# Altium schematic sheet Measuring_distance_ultrasonic_Sheet.SchDoc
size A2
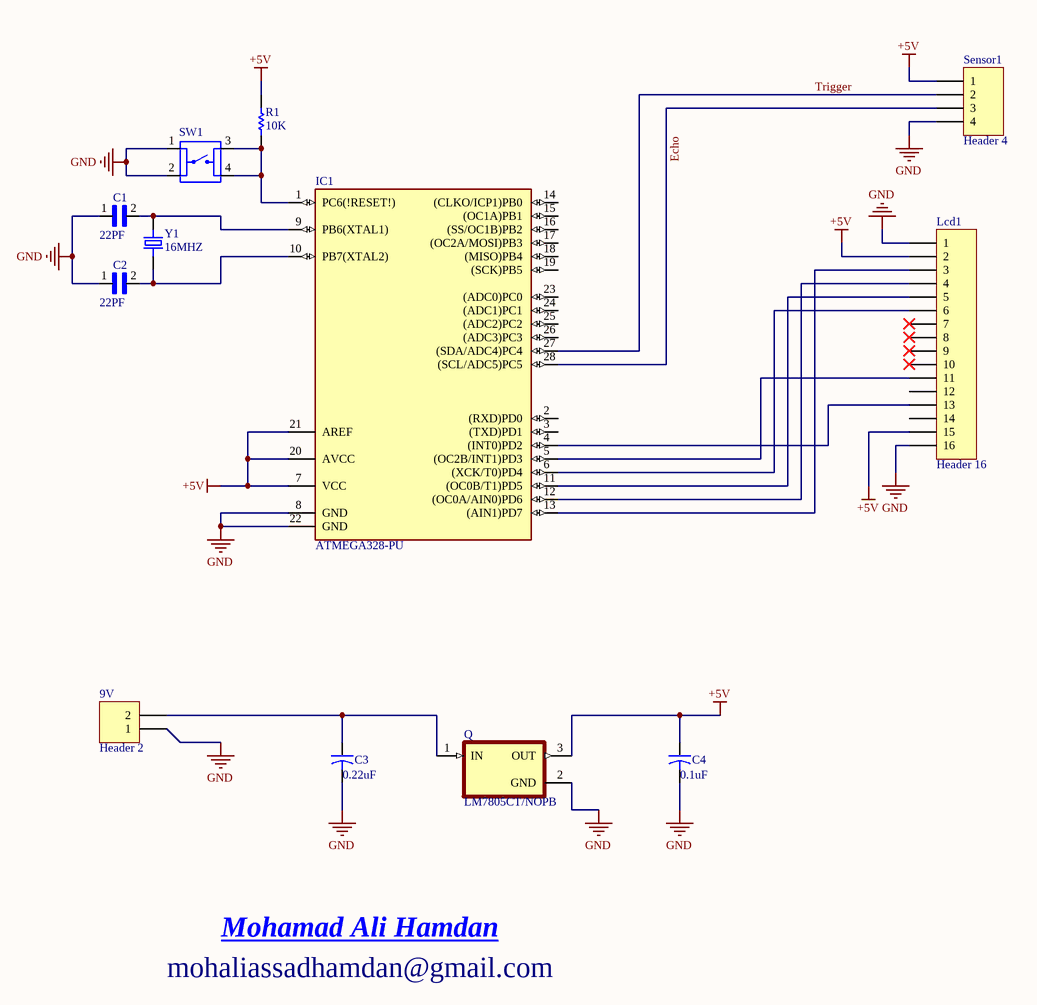
[diagram p0: Measuring_distance_ultrasonic_Sheet.SchDoc]

## Parts
9V  Header 2  [Connector_green_2pins]
C1  BuyPart: 22PF  [CAP_RDER71H333K0M1H03A]  (hidden comment: 14pF)
C2  BuyPart: 22PF  [CAP_RDER71H333K0M1H03A]  (hidden comment: 14pF)
C3  value 0.22uF  [Capacitor_polarized_100uF]  (hidden comment: Cap2)
C4  value 0.1uF  [Capacitor_polarized_100uF]  (hidden comment: Cap2)
IC1  ATMEGA328-PU  [DIL28]
Lcd1  Header 16  [LCD_16_2]
Q  LM7805CT/NOPB  [LM7805]
R1  value 10K  [resistor]  (hidden comment: Res1)
Sensor1  Header 4  [header_4]
SW1  FSM8JH  [SW_FSM8JH]  (value not drawn)
Y1  16MHZ  [XTAL_ECS-160-20-4VX]

## Nets
+5V: C4.1 IC1.7(VCC) IC1.20(AVCC) IC1.21(AREF) Lcd1.2 Lcd1.15 Q.3(OUT) R1.2 Sensor1.1
GND: 9V.1 C1.1 C2.1 C3.2 C4.2 IC1.8(GND) IC1.22(GND) Lcd1.1 Lcd1.16 Q.2(GND) Sensor1.4 SW1.1 SW1.2
Echo: IC1.28((SCL/ADC5)PC5) Sensor1.3
Trigger: IC1.27((SDA/ADC4)PC4) Sensor1.2
Net9V_2: 9V.2 C3.1 Q.1(IN)
NetC1_2: C1.2 IC1.9(PB6(XTAL1)) Y1.2
NetC2_2: C2.2 IC1.10(PB7(XTAL2)) Y1.1
NetIC1_1: IC1.1(PC6(!RESET!)) R1.1 SW1.3 SW1.4
NetIC1_4: IC1.4((INT0)PD2) Lcd1.13
NetIC1_5: IC1.5((OC2B/INT1)PD3) Lcd1.11
NetIC1_6: IC1.6((XCK/T0)PD4) Lcd1.6
NetIC1_11: IC1.11((OC0B/T1)PD5) Lcd1.5
NetIC1_12: IC1.12((OC0A/AIN0)PD6) Lcd1.4
NetIC1_13: IC1.13((AIN1)PD7) Lcd1.3

Not connected (* = marked no-connect by the designer): IC1 2((RXD)PD0) 3((TXD)PD1) 14((CLKO/ICP1)PB0) 15((OC1A)PB1) 16((SS/OC1B)PB2) 17((OC2A/MOSI)PB3) 18((MISO)PB4) 19((SCK)PB5) 23((ADC0)PC0) 24((ADC1)PC1) 25((ADC2)PC2) 26((ADC3)PC3); Lcd1 7* 8* 9* 10* 12 14

## Notes on the sheet
- mohaliassadhamdan@gmail.com
- Mohamad Ali Hamdan

## Library data of the parts
9V = Header 2: Header, 2-Pin; LatestRevisionDate: 17-Jul-2002; LatestRevisionNote: Re-released for DXP Platform.; Publisher: Altium Limited
C1 C2 = RDER71H333K0M1H03A: Lead capacitor X7R(EIA) with Capacitance 33000pF, Rated Voltage 50Vdc; MF: Murata; SnapEDA_Link: https://www.snapeda.com/parts/RDER71H333K0M1H03A/Murata/view-part/4546735/?ref=snap; Availability: Warning; Price: None; Package: Radial Murata; Value: *; MP: RDER71H333K0M1H03A; Mouser-Purchase-URL: https://snapeda.com/shop?store=Mouser&id=4546735
C3 C4 = Cap2: Capacitor; pin to pad: 1>+ 2>-; Published: 23-Sep-2002; PackageReference: CAPR5-4X5; Publisher: Altium Limited; PackageDescription: Capacitor; 2 Leads
IC1 = ATMEGA328-PU: AVR AVRÂ® ATmega Microcontroller IC 8-Bit 20MHz 32KB _16K x 16_ FLASH 28-PDIP; MF: Microchip Technology; Package: DIP-28 Microchip Technology; Price: None; Availability: Unavailable; MP: ATMEGA328-PU; SnapEDA_Link: https://www.snapeda.com/parts/ATMEGA328-PU/Microchip/view-part/4327846/?ref=snap; Value: *
Lcd1 = Header 16: Header, 16-Pin; LatestRevisionDate: 17-Jul-2002; LatestRevisionNote: Re-released for DXP Platform.; Publisher: Altium Limited
Q = LM7805CT/NOPB: Linear Voltage Regulator IC 1 Output 1A TO-220-3; MF: ON Semiconductor; MP: LM7805CT; SnapEDA_Link: https://www.snapeda.com/parts/LM7805CT/ON%20Semiconductor/view-part/546231/?ref=snap; Price: None; Package: TO-220 ON Semiconductor; Value: *; Availability: Unavailable
R1 = Res1: Resistor; Published: 8-Jun-2000; LatestRevisionDate: 17-Jul-2002; LatestRevisionNote: Re-released for DXP Platform.; PackageReference: AXIAL-0.3; Publisher: Altium Limited; PackageDescription: Axial Device, Thru-Hole; 2 Leads; 0.3 in Pin Spacing
Sensor1 = Header 4: Header, 4-Pin; LatestRevisionDate: 17-Jul-2002; LatestRevisionNote: Re-released for DXP Platform.; Publisher: Altium Limited
SW1 = FSM8JH: Tactile Switch SPST-NO Top Actuated Through Hole; MF: TE Connectivity; MP: FSM8JH; SnapEDA_Link: https://www.snapeda.com/parts/FSM8JH/TE%20Connectivity%20ALCOSWITCH%20Switches/view-part/139741/?ref=snap; Price: None; Package: None; TE_purchase_URL: https://www.te.com/usa-en/product-FSM8JH.html?te_bu=Cor&te_type=disp&te_campaign=seda_glo_cor-seda-global-disp-prtnr-fy19-seda-model-bom-cta_sma-317_1&elqCampaignId=32493; Value: *; Availability: Unavailable
Y1 = ECS-160-20-4VX: 16MHz Â±30ppm Crystal 20pF 50 Ohms HC-49/US; MF: ECS Inc.; SnapEDA_Link: https://www.snapeda.com/parts/ECS-160-20-4VX/ECS%20Inc./view-part/47293/?ref=snap; Availability: Unavailable; Value: *; Price: None; MP: ECS-160-20-4VX; Package: HC49/US ECS International